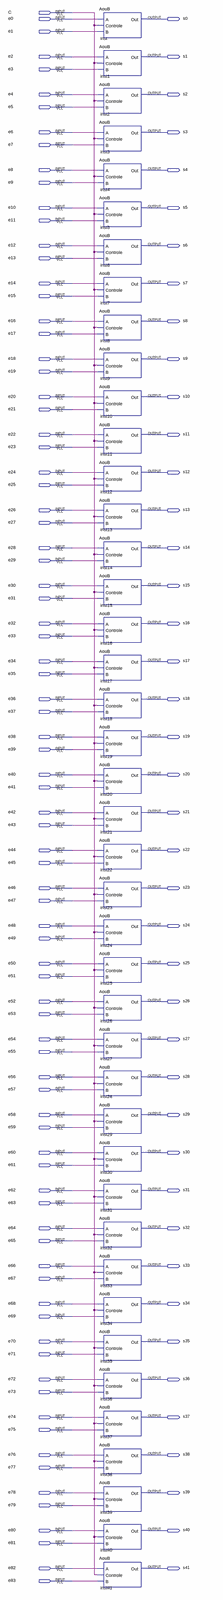
[diagram p0: schematic sheet, whole]
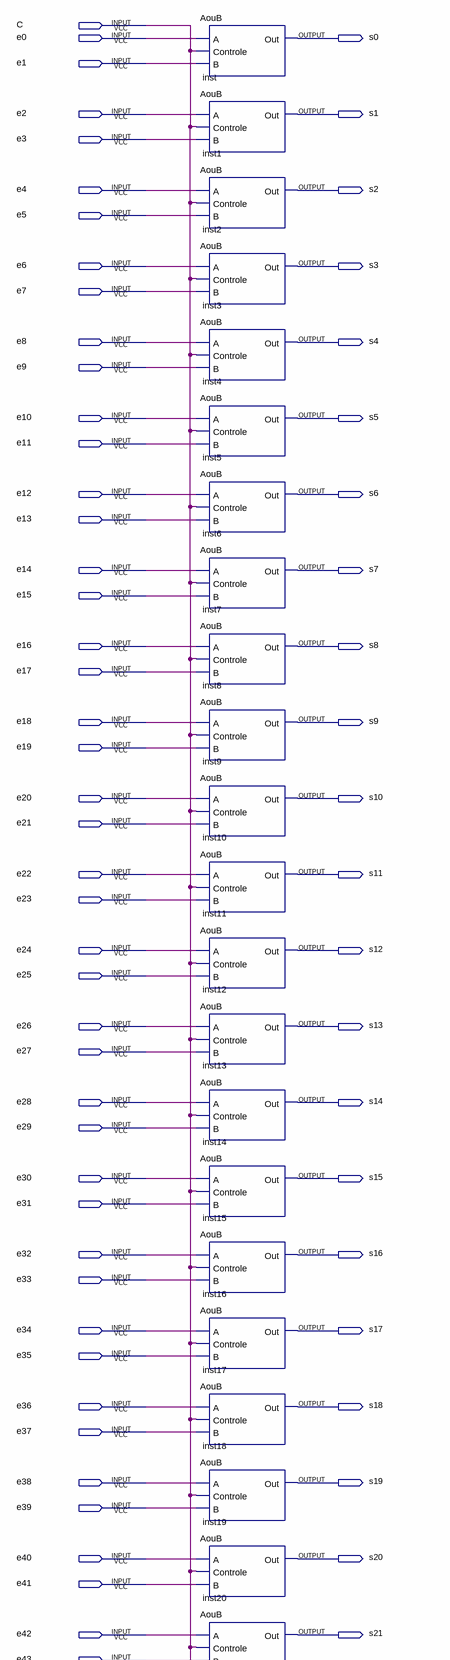
[diagram p1: schematic sheet, upper part]
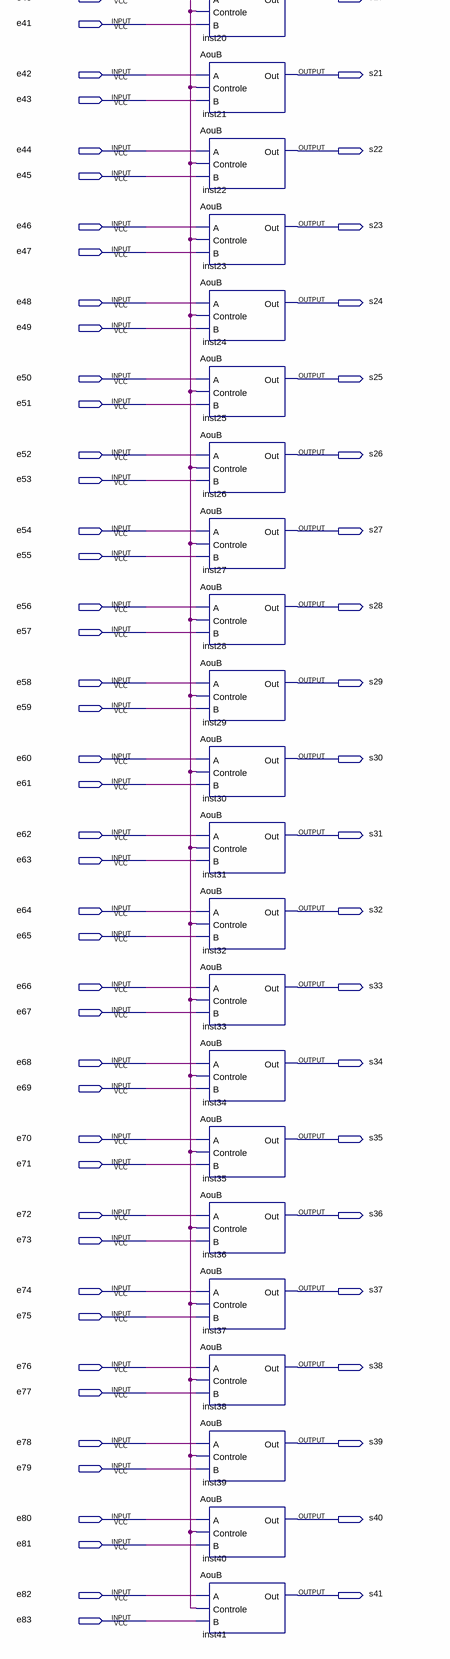
[diagram p2: schematic sheet, lower part]
// Quartus schematic AouBx42.bdf as structural Verilog: 42 symbols, 127 pins
module AouBx42 (
  input  C,
  input  e0,
  input  e1,
  input  e2,
  input  e3,
  input  e4,
  input  e5,
  input  e6,
  input  e7,
  input  e8,
  input  e9,
  input  e10,
  input  e11,
  input  e12,
  input  e13,
  input  e14,
  input  e15,
  input  e16,
  input  e17,
  input  e18,
  input  e19,
  input  e20,
  input  e21,
  input  e22,
  input  e23,
  input  e24,
  input  e25,
  input  e26,
  input  e27,
  input  e28,
  input  e29,
  input  e30,
  input  e31,
  input  e32,
  input  e33,
  input  e34,
  input  e35,
  input  e36,
  input  e37,
  input  e38,
  input  e39,
  input  e40,
  input  e41,
  input  e42,
  input  e43,
  input  e44,
  input  e45,
  input  e46,
  input  e47,
  input  e48,
  input  e49,
  input  e50,
  input  e51,
  input  e52,
  input  e53,
  input  e54,
  input  e55,
  input  e56,
  input  e57,
  input  e58,
  input  e59,
  input  e60,
  input  e61,
  input  e62,
  input  e63,
  input  e64,
  input  e65,
  input  e66,
  input  e67,
  input  e68,
  input  e69,
  input  e70,
  input  e71,
  input  e72,
  input  e73,
  input  e74,
  input  e75,
  input  e76,
  input  e77,
  input  e78,
  input  e79,
  input  e80,
  input  e81,
  input  e82,
  input  e83,
  output s0,
  output s1,
  output s2,
  output s3,
  output s4,
  output s5,
  output s6,
  output s7,
  output s8,
  output s9,
  output s10,
  output s11,
  output s12,
  output s13,
  output s14,
  output s15,
  output s16,
  output s17,
  output s18,
  output s19,
  output s20,
  output s21,
  output s22,
  output s23,
  output s24,
  output s25,
  output s26,
  output s27,
  output s28,
  output s29,
  output s30,
  output s31,
  output s32,
  output s33,
  output s34,
  output s35,
  output s36,
  output s37,
  output s38,
  output s39,
  output s40,
  output s41
);

  AouB inst (.A(e0), .Controle(C), .B(e1), .Out(s0));
  AouB inst1 (.A(e2), .Controle(C), .B(e3), .Out(s1));
  AouB inst2 (.A(e4), .Controle(C), .B(e5), .Out(s2));
  AouB inst3 (.A(e6), .Controle(C), .B(e7), .Out(s3));
  AouB inst4 (.A(e8), .Controle(C), .B(e9), .Out(s4));
  AouB inst5 (.A(e10), .Controle(C), .B(e11), .Out(s5));
  AouB inst6 (.A(e12), .Controle(C), .B(e13), .Out(s6));
  AouB inst7 (.A(e14), .Controle(C), .B(e15), .Out(s7));
  AouB inst8 (.A(e16), .Controle(C), .B(e17), .Out(s8));
  AouB inst9 (.A(e18), .Controle(C), .B(e19), .Out(s9));
  AouB inst10 (.A(e20), .Controle(C), .B(e21), .Out(s10));
  AouB inst11 (.A(e22), .Controle(C), .B(e23), .Out(s11));
  AouB inst12 (.A(e24), .Controle(C), .B(e25), .Out(s12));
  AouB inst13 (.A(e26), .Controle(C), .B(e27), .Out(s13));
  AouB inst14 (.A(e28), .Controle(C), .B(e29), .Out(s14));
  AouB inst15 (.A(e30), .Controle(C), .B(e31), .Out(s15));
  AouB inst16 (.A(e32), .Controle(C), .B(e33), .Out(s16));
  AouB inst17 (.A(e34), .Controle(C), .B(e35), .Out(s17));
  AouB inst18 (.A(e36), .Controle(C), .B(e37), .Out(s18));
  AouB inst19 (.A(e38), .Controle(C), .B(e39), .Out(s19));
  AouB inst20 (.A(e40), .Controle(C), .B(e41), .Out(s20));
  AouB inst21 (.A(e42), .Controle(C), .B(e43), .Out(s21));
  AouB inst22 (.A(e44), .Controle(C), .B(e45), .Out(s22));
  AouB inst23 (.A(e46), .Controle(C), .B(e47), .Out(s23));
  AouB inst24 (.A(e48), .Controle(C), .B(e49), .Out(s24));
  AouB inst25 (.A(e50), .Controle(C), .B(e51), .Out(s25));
  AouB inst26 (.A(e52), .Controle(C), .B(e53), .Out(s26));
  AouB inst27 (.A(e54), .Controle(C), .B(e55), .Out(s27));
  AouB inst28 (.A(e56), .Controle(C), .B(e57), .Out(s28));
  AouB inst29 (.A(e58), .Controle(C), .B(e59), .Out(s29));
  AouB inst30 (.A(e60), .Controle(C), .B(e61), .Out(s30));
  AouB inst31 (.A(e62), .Controle(C), .B(e63), .Out(s31));
  AouB inst32 (.A(e64), .Controle(C), .B(e65), .Out(s32));
  AouB inst33 (.A(e66), .Controle(C), .B(e67), .Out(s33));
  AouB inst34 (.A(e68), .Controle(C), .B(e69), .Out(s34));
  AouB inst35 (.A(e70), .Controle(C), .B(e71), .Out(s35));
  AouB inst36 (.A(e72), .Controle(C), .B(e73), .Out(s36));
  AouB inst37 (.A(e74), .Controle(C), .B(e75), .Out(s37));
  AouB inst38 (.A(e76), .Controle(C), .B(e77), .Out(s38));
  AouB inst39 (.A(e78), .Controle(C), .B(e79), .Out(s39));
  AouB inst40 (.A(e80), .Controle(C), .B(e81), .Out(s40));
  AouB inst41 (.A(e82), .Controle(C), .B(e83), .Out(s41));
endmodule
